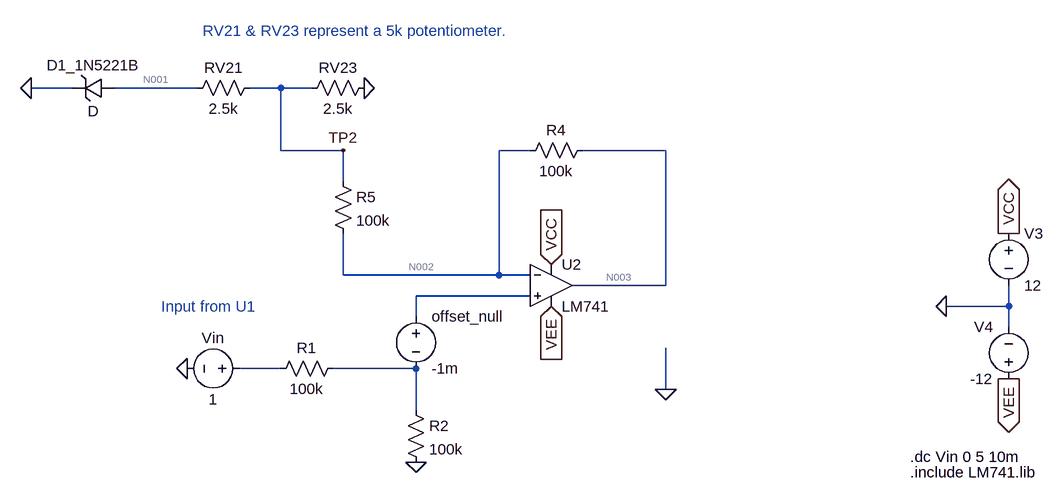
[diagram p0: schematic ProjectU2.asc]
ProjectU2.asc, the LTspice schematic file:
Version 4
SHEET 1 984 856
WIRE -672 -240 -736 -240
WIRE -480 -240 -608 -240
WIRE -352 -240 -400 -240
WIRE -304 -240 -352 -240
WIRE -352 -144 -352 -240
WIRE -256 -144 -352 -144
WIRE 32 -144 -16 -144
WIRE 240 -144 112 -144
WIRE -256 -96 -256 -144
WIRE -256 48 -256 -16
WIRE -16 48 -16 -144
WIRE -16 48 -256 48
WIRE 32 48 -16 48
WIRE 240 64 240 -144
WIRE 240 64 96 64
WIRE 32 80 -144 80
WIRE 768 96 768 64
WIRE 768 96 672 96
WIRE -144 112 -144 80
WIRE 768 128 768 96
WIRE -352 192 -416 192
WIRE -144 192 -272 192
WIRE 240 224 240 160
WIRE -144 256 -144 192
FLAG 64 96 VEE
IOPIN 64 96 In
FLAG 64 32 VCC
IOPIN 64 32 In
FLAG 672 96 0
FLAG 768 -16 VCC
IOPIN 768 -16 Out
FLAG 768 208 VEE
IOPIN 768 208 Out
FLAG 240 224 0
FLAG -496 192 0
FLAG -144 336 0
FLAG -256 -144 TP2
FLAG -224 -240 0
FLAG -736 -240 0
SYMBOL voltage 768 -32 R0
SYMATTR InstName V3
SYMATTR Value 12
SYMBOL voltage 768 224 R180
WINDOW 0 24 96 Left 2
WINDOW 3 24 16 Left 2
SYMATTR InstName V4
SYMATTR Value -12
SYMBOL OpAmps\\opamp2 64 0 R0
SYMATTR InstName U2
SYMATTR Value LM741
SYMBOL voltage -144 96 R0
WINDOW 123 0 0 Left 0
WINDOW 39 0 0 Left 0
SYMATTR InstName offset_null
SYMATTR Value -1m
SYMBOL res -160 240 R0
SYMATTR InstName R2
SYMATTR Value 100k
SYMBOL res -256 176 R90
WINDOW 0 0 56 VBottom 2
WINDOW 3 32 56 VTop 2
SYMATTR InstName R1
SYMATTR Value 100k
SYMBOL voltage -400 192 R90
WINDOW 0 -32 56 VBottom 2
WINDOW 3 32 56 VTop 2
SYMATTR InstName Vin
SYMATTR Value 1
SYMBOL res 128 -160 R90
WINDOW 0 0 56 VBottom 2
WINDOW 3 32 56 VTop 2
SYMATTR InstName R4
SYMATTR Value 100k
SYMBOL res -272 -112 R0
SYMATTR InstName R5
SYMATTR Value 100k
SYMBOL res -208 -256 R90
WINDOW 0 0 56 VBottom 2
WINDOW 3 32 56 VTop 2
SYMATTR InstName RV23
SYMATTR Value 2.5k
SYMBOL res -384 -256 R90
WINDOW 0 0 56 VBottom 2
WINDOW 3 32 56 VTop 2
SYMATTR InstName RV21
SYMATTR Value 2.5k
SYMBOL zener -608 -256 R90
WINDOW 0 -4 32 VBottom 2
WINDOW 3 36 32 VTop 2
SYMATTR InstName D1_1N5221B
TEXT 616 352 Left 2 !.include LM741.lib
TEXT 616 328 Left 2 !.dc Vin 0 5 10m
TEXT -536 96 Left 2 ;Input from U1
TEXT -472 -328 Left 2 ;RV21 & RV23 represent a 5k potentiometer.

The netlist it stands for:
* ProjectU2.asc
V3 VCC 0 12
V4 VEE 0 -12
XU2 N004 N002 VCC VEE N003 LM741  ; pins In+ In- V+ V- OUT
V§offset_null N004 N006 -1m
R2 N006 0 100k
R1 N006 N005 100k
Vin N005 0 1
R4 N003 N002 100k
R5 TP2 N002 100k
RV23 0 TP2 2.5k
RV21 TP2 N001 2.5k
D1_1N5221B N001 0 D
.model D D
.lib standard.dio
.include LM741.lib
.dc Vin 0 5 10m
* Input from U1
* RV21 & RV23 represent a 5k potentiometer.
.backanno
.end

* Results of the author's LTspice run, read from the files saved beside the schematic
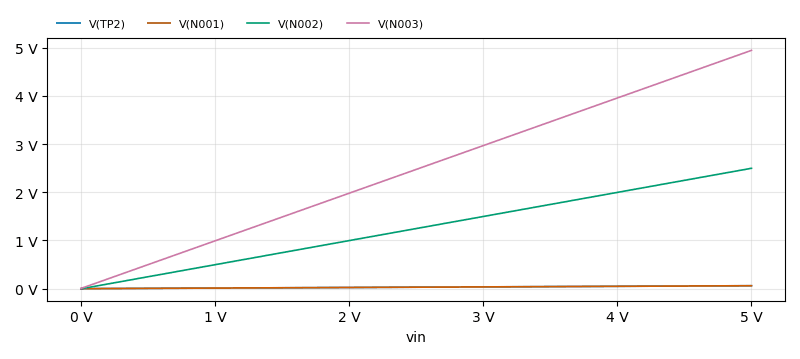
[diagram p1: DC transfer characteristic of ProjectU2.asc, plotted from the saved traces]
* DC transfer characteristic, 1 run:
*   V(TP2): -70.57 µV at vin=0 V, 60.91 mV at vin=5 V, min -70.57 µV, max 60.91 mV
*   V(N001): -70.57 µV at vin=0 V, 60.91 mV at vin=5 V, min -70.57 µV, max 60.91 mV
*   V(N002): -2.893 mV at vin=0 V, 2.497 V at vin=5 V, min -2.893 mV, max 2.497 V
*   V(N003): 4.47 mV at vin=0 V, 4.944 V at vin=5 V, min 4.47 mV, max 4.944 V